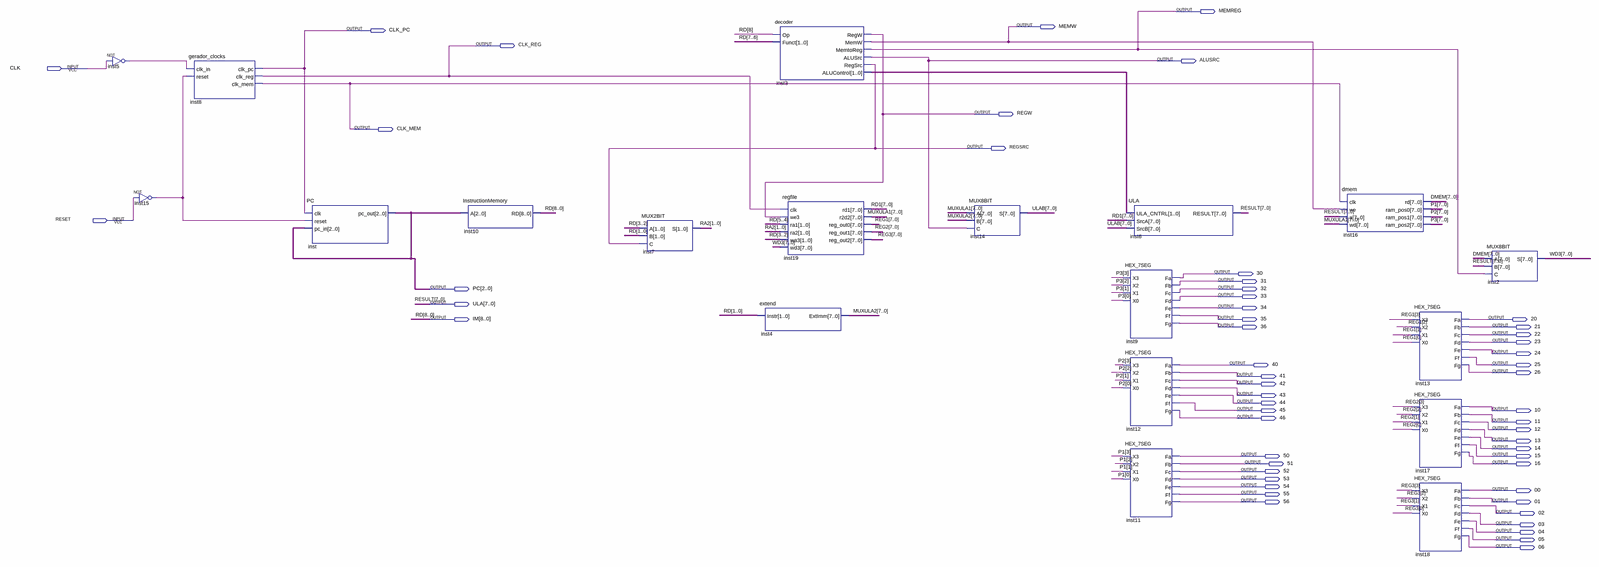
[diagram p0: schematic sheet, whole]
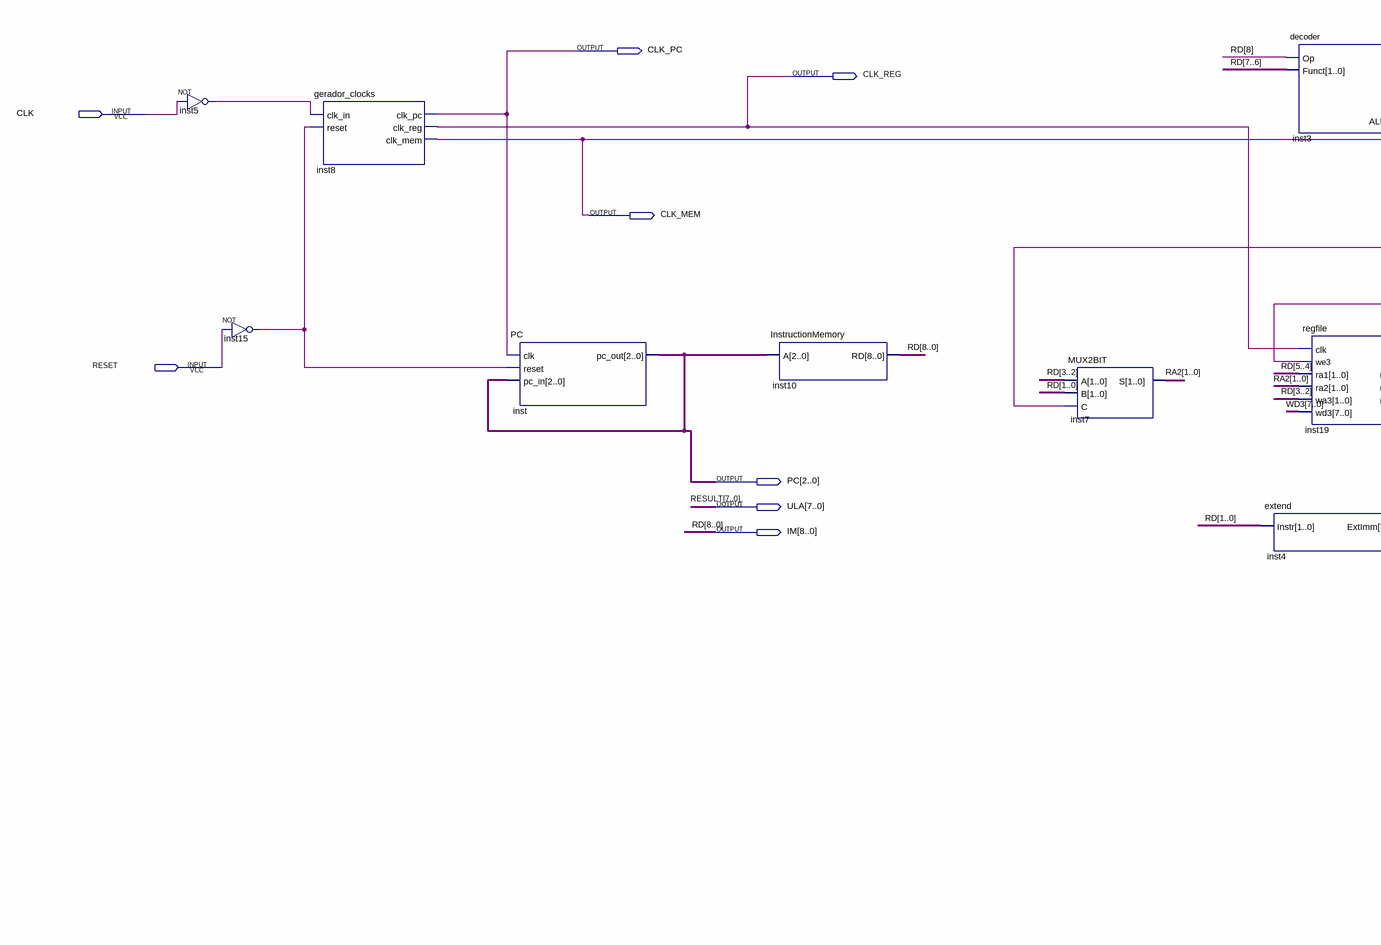
[diagram p1: schematic sheet, left part]
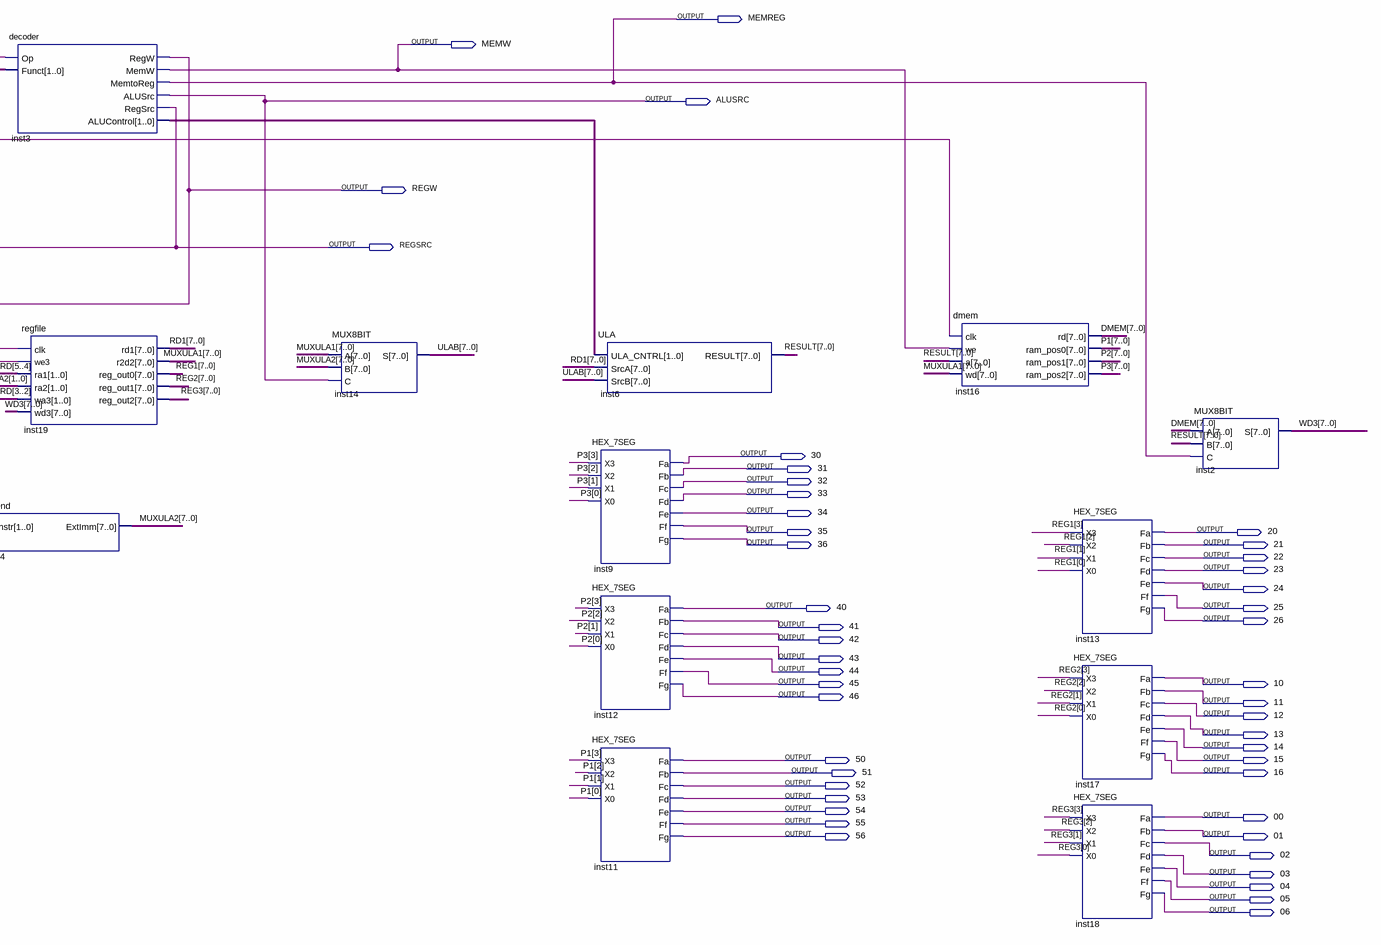
[diagram p2: schematic sheet, right part]
// Quartus schematic Processador8bits.bdf as structural Verilog: 19 symbols, 55 pins
module Processador8bits (
  input  CLK,
  input  RESET,
  output MEMREG,
  output MEMW,
  output CLK_PC,
  output CLK_REG,
  output ALUSRC,
  output REGW,
  output CLK_MEM,
  output REGSRC,
  output \30 ,
  output \31 ,
  output [2:0] PC,
  output \32 ,
  output \33 ,
  output [7:0] ULA,
  output \34 ,
  output [8:0] IM,
  output \35 ,
  output \20 ,
  output \36 ,
  output \21 ,
  output \22 ,
  output \23 ,
  output \24 ,
  output \40 ,
  output \25 ,
  output \26 ,
  output \41 ,
  output \42 ,
  output \43 ,
  output \44 ,
  output \45 ,
  output \10 ,
  output \46 ,
  output \11 ,
  output \12 ,
  output \13 ,
  output \14 ,
  output \50 ,
  output \15 ,
  output \51 ,
  output \16 ,
  output \52 ,
  output \53 ,
  output \54 ,
  output \00 ,
  output \55 ,
  output \56 ,
  output \01 ,
  output \02 ,
  output \03 ,
  output \04 ,
  output \05 ,
  output \06 
);

  wire inst5_out, inst15_out;
  wire [1:0] inst3_alucontrol, RA2;
  wire [7:0] DMEM, MUXULA1, MUXULA2, P1, P2, P3, RD1, REG1, REG2, REG3, ULAB, WD3;

  not inst5 (inst5_out, CLK);
  not inst15 (inst15_out, RESET);
  gerador_clocks inst8 (.clk_in(inst5_out), .reset(inst15_out), .clk_pc(CLK_PC), .clk_reg(CLK_REG), .clk_mem(CLK_MEM));
  PC inst (.clk(CLK_PC), .reset(inst15_out), .pc_in(PC), .pc_out(PC));
  InstructionMemory inst10 (.A(PC), .RD(IM));
  MUX2BIT inst7 (.A(IM[3:2]), .B(IM[1:0]), .C(REGSRC), .S(RA2));
  decoder inst3 (
    .Op(IM[8]), .Funct(IM[7:6]), .RegW(REGW), .MemW(MEMW), .MemtoReg(MEMREG), .ALUSrc(ALUSRC),
    .RegSrc(REGSRC), .ALUControl(inst3_alucontrol));
  regfile inst19 (
    .clk(CLK_REG), .we3(REGW), .ra1(IM[5:4]), .ra2(RA2), .wa3(IM[3:2]), .wd3(WD3), .rd1(RD1), .r2d2(MUXULA1),
    .reg_out0(REG1), .reg_out1(REG2), .reg_out2(REG3));
  extend inst4 (.Instr(IM[1:0]), .ExtImm(MUXULA2));
  MUX8BIT inst14 (.A(MUXULA1), .B(MUXULA2), .C(ALUSRC), .S(ULAB));
  ULA inst6 (.ULA_CNTRL(inst3_alucontrol), .SrcA(RD1), .SrcB(ULAB), .RESULT(ULA));
  HEX_7SEG inst9 (
    .X3(P3[3]), .X2(P3[2]), .X1(P3[1]), .X0(P3[0]), .Fa(\30 ), .Fb(\31 ), .Fc(\32 ), .Fd(\33 ), .Fe(\34 ),
    .Ff(\35 ), .Fg(\36 ));
  HEX_7SEG inst12 (
    .X3(P2[3]), .X2(P2[2]), .X1(P2[1]), .X0(P2[0]), .Fa(\40 ), .Fb(\41 ), .Fc(\42 ), .Fd(\43 ), .Fe(\44 ),
    .Ff(\45 ), .Fg(\46 ));
  HEX_7SEG inst11 (
    .X3(P1[3]), .X2(P1[2]), .X1(P1[1]), .X0(P1[0]), .Fa(\50 ), .Fb(\51 ), .Fc(\52 ), .Fd(\53 ), .Fe(\54 ),
    .Ff(\55 ), .Fg(\56 ));
  dmem inst16 (.clk(CLK_MEM), .we(MEMW), .a(ULA), .wd(MUXULA1), .rd(DMEM), .ram_pos0(P1), .ram_pos1(P2), .ram_pos2(P3));
  HEX_7SEG inst13 (
    .X3(REG1[3]), .X2(REG1[2]), .X1(REG1[1]), .X0(REG1[0]), .Fa(\20 ), .Fb(\21 ), .Fc(\22 ), .Fd(\23 ),
    .Fe(\24 ), .Ff(\25 ), .Fg(\26 ));
  HEX_7SEG inst17 (
    .X3(REG2[3]), .X2(REG2[2]), .X1(REG2[1]), .X0(REG2[0]), .Fa(\10 ), .Fb(\11 ), .Fc(\12 ), .Fd(\13 ),
    .Fe(\14 ), .Ff(\15 ), .Fg(\16 ));
  HEX_7SEG inst18 (
    .X3(REG3[3]), .X2(REG3[2]), .X1(REG3[1]), .X0(REG3[0]), .Fa(\00 ), .Fb(\01 ), .Fc(\02 ), .Fd(\03 ),
    .Fe(\04 ), .Ff(\05 ), .Fg(\06 ));
  MUX8BIT inst2 (.A(DMEM), .B(ULA), .C(MEMREG), .S(WD3));

  // Other names for the same wires on the sheet: RD[8:0] = IM; RESULT[7:0] = ULA
endmodule
